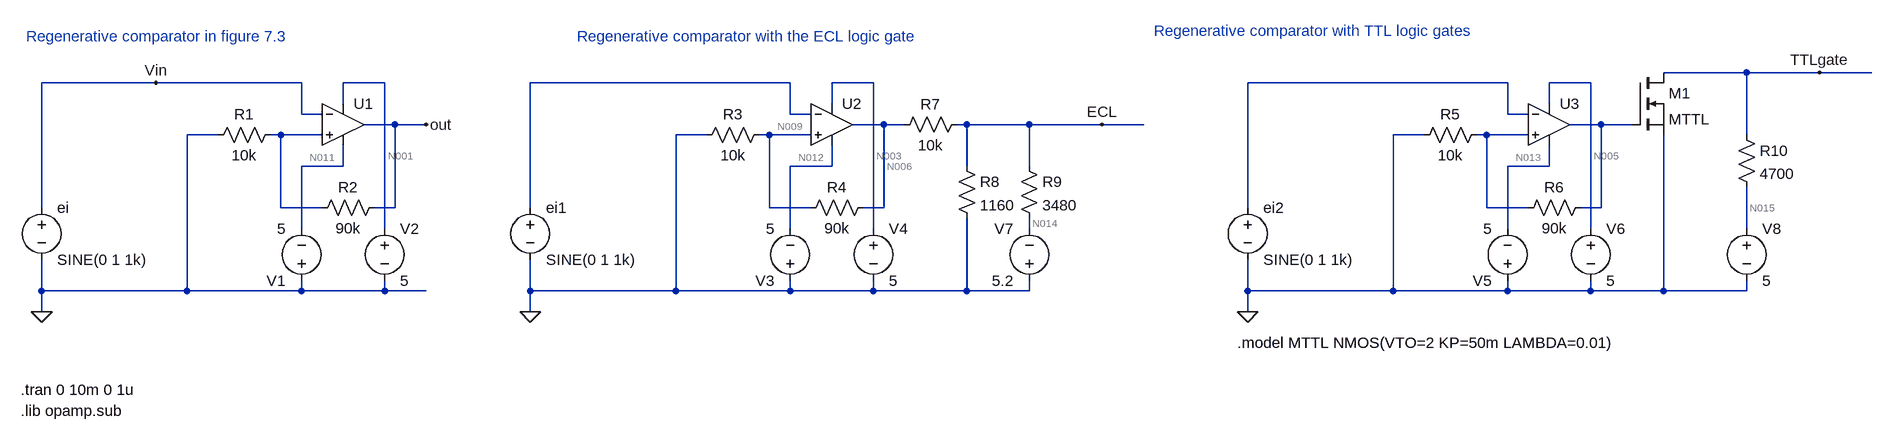
[diagram p0: schematic hw4.asc]
hw4.asc, the LTspice schematic file:
Version 4.1
SHEET 1 2436 680
WIRE 2240 64 2112 64
WIRE 2352 64 2240 64
WIRE 2432 64 2352 64
WIRE -208 80 -384 80
WIRE 16 80 -208 80
WIRE 144 80 80 80
WIRE 768 80 368 80
WIRE 896 80 832 80
WIRE 1872 80 1472 80
WIRE 2000 80 1936 80
WIRE 80 112 80 80
WIRE 832 112 832 80
WIRE 1936 112 1936 80
WIRE 16 128 16 80
WIRE 48 128 16 128
WIRE 768 128 768 80
WIRE 800 128 768 128
WIRE 1872 128 1872 80
WIRE 1904 128 1872 128
WIRE 160 144 112 144
WIRE 208 144 160 144
WIRE 912 144 864 144
WIRE 944 144 912 144
WIRE 1040 144 1024 144
WIRE 1136 144 1040 144
WIRE 1248 144 1136 144
WIRE 1312 144 1248 144
WIRE 2016 144 1968 144
WIRE 2064 144 2016 144
WIRE -112 160 -160 160
WIRE -16 160 -32 160
WIRE 48 160 -16 160
WIRE 640 160 592 160
WIRE 736 160 720 160
WIRE 800 160 736 160
WIRE 1744 160 1696 160
WIRE 1840 160 1824 160
WIRE 1904 160 1840 160
WIRE 2240 160 2240 64
WIRE 80 208 80 176
WIRE 80 208 16 208
WIRE 832 208 832 176
WIRE 832 208 768 208
WIRE 1040 208 1040 144
WIRE 1136 208 1136 144
WIRE 1936 208 1936 176
WIRE 1936 208 1872 208
WIRE -384 272 -384 80
WIRE -16 272 -16 160
WIRE 48 272 -16 272
WIRE 160 272 160 144
WIRE 160 272 128 272
WIRE 368 272 368 80
WIRE 736 272 736 160
WIRE 800 272 736 272
WIRE 912 272 912 144
WIRE 912 272 880 272
WIRE 1472 272 1472 80
WIRE 1840 272 1840 160
WIRE 1904 272 1840 272
WIRE 2016 272 2016 144
WIRE 2016 272 1984 272
WIRE 16 304 16 208
WIRE 144 304 144 80
WIRE 768 304 768 208
WIRE 896 304 896 80
WIRE 1136 304 1136 288
WIRE 1872 304 1872 208
WIRE 2000 304 2000 80
WIRE 2240 304 2240 240
WIRE -384 400 -384 352
WIRE -160 400 -160 160
WIRE -160 400 -384 400
WIRE 16 400 16 384
WIRE 16 400 -160 400
WIRE 144 400 144 384
WIRE 144 400 16 400
WIRE 208 400 144 400
WIRE 368 400 368 352
WIRE 592 400 592 160
WIRE 592 400 368 400
WIRE 768 400 768 384
WIRE 768 400 592 400
WIRE 896 400 896 384
WIRE 896 400 768 400
WIRE 1040 400 1040 288
WIRE 1040 400 896 400
WIRE 1136 400 1136 384
WIRE 1136 400 1040 400
WIRE 1472 400 1472 352
WIRE 1696 400 1696 160
WIRE 1696 400 1472 400
WIRE 1872 400 1872 384
WIRE 1872 400 1696 400
WIRE 2000 400 2000 384
WIRE 2000 400 1872 400
WIRE 2112 400 2112 160
WIRE 2112 400 2000 400
WIRE 2240 400 2240 384
WIRE 2240 400 2112 400
WIRE -384 432 -384 400
WIRE 368 432 368 400
WIRE 1472 432 1472 400
FLAG -384 432 0
FLAG 368 432 0
FLAG 1472 432 0
FLAG 208 144 out
FLAG 1248 144 ECL
FLAG 2352 64 TTLgate
FLAG -208 80 Vin
SYMBOL voltage -384 256 R0
WINDOW 123 0 0 Left 0
WINDOW 39 0 0 Left 0
SYMATTR InstName ei
SYMATTR Value SINE(0 1 1k)
SYMBOL res -16 144 R90
WINDOW 0 0 56 VBottom 2
WINDOW 3 32 56 VTop 2
SYMATTR InstName R1
SYMATTR Value 10k
SYMBOL res 144 256 R90
WINDOW 0 0 56 VBottom 2
WINDOW 3 32 56 VTop 2
SYMATTR InstName R2
SYMATTR Value 90k
SYMBOL voltage 16 400 R180
WINDOW 123 0 0 Left 0
WINDOW 39 0 0 Left 0
SYMATTR InstName V1
SYMATTR Value 5
SYMBOL voltage 144 288 R0
WINDOW 123 0 0 Left 0
WINDOW 39 0 0 Left 0
SYMATTR InstName V2
SYMATTR Value 5
SYMBOL OpAmps\\UniversalOpAmp2 80 144 R0
SYMATTR InstName U1
SYMBOL voltage 368 256 R0
WINDOW 123 0 0 Left 0
WINDOW 39 0 0 Left 0
SYMATTR InstName ei1
SYMATTR Value SINE(0 1 1k)
SYMBOL res 736 144 R90
WINDOW 0 0 56 VBottom 2
WINDOW 3 32 56 VTop 2
SYMATTR InstName R3
SYMATTR Value 10k
SYMBOL res 896 256 R90
WINDOW 0 0 56 VBottom 2
WINDOW 3 32 56 VTop 2
SYMATTR InstName R4
SYMATTR Value 90k
SYMBOL voltage 768 400 R180
WINDOW 123 0 0 Left 0
WINDOW 39 0 0 Left 0
SYMATTR InstName V3
SYMATTR Value 5
SYMBOL voltage 896 288 R0
WINDOW 123 0 0 Left 0
WINDOW 39 0 0 Left 0
SYMATTR InstName V4
SYMATTR Value 5
SYMBOL OpAmps\\UniversalOpAmp2 832 144 R0
SYMATTR InstName U2
SYMBOL voltage 1472 256 R0
WINDOW 123 0 0 Left 0
WINDOW 39 0 0 Left 0
SYMATTR InstName ei2
SYMATTR Value SINE(0 1 1k)
SYMBOL res 1840 144 R90
WINDOW 0 0 56 VBottom 2
WINDOW 3 32 56 VTop 2
SYMATTR InstName R5
SYMATTR Value 10k
SYMBOL res 2000 256 R90
WINDOW 0 0 56 VBottom 2
WINDOW 3 32 56 VTop 2
SYMATTR InstName R6
SYMATTR Value 90k
SYMBOL voltage 1872 400 R180
WINDOW 123 0 0 Left 0
WINDOW 39 0 0 Left 0
SYMATTR InstName V5
SYMATTR Value 5
SYMBOL voltage 2000 288 R0
WINDOW 123 0 0 Left 0
WINDOW 39 0 0 Left 0
SYMATTR InstName V6
SYMATTR Value 5
SYMBOL OpAmps\\UniversalOpAmp2 1936 144 R0
SYMATTR InstName U3
SYMBOL res 1040 128 R90
WINDOW 0 0 56 VBottom 2
WINDOW 3 32 56 VTop 2
SYMATTR InstName R7
SYMATTR Value 10k
SYMBOL res 1024 192 R0
SYMATTR InstName R8
SYMATTR Value 1160
SYMBOL res 1120 192 R0
SYMATTR InstName R9
SYMATTR Value 3480
SYMBOL voltage 1136 400 R180
WINDOW 0 24 96 Left 2
WINDOW 3 24 16 Left 2
WINDOW 123 0 0 Left 0
WINDOW 39 0 0 Left 0
SYMATTR InstName V7
SYMATTR Value 5.2
SYMBOL nmos 2064 64 R0
SYMATTR InstName M1
SYMATTR Value MTTL
SYMBOL voltage 2240 288 R0
WINDOW 123 0 0 Left 0
WINDOW 39 0 0 Left 0
SYMATTR InstName V8
SYMATTR Value 5
SYMBOL res 2224 144 R0
SYMATTR InstName R10
SYMATTR Value 4700
TEXT -416 552 Left 2 !.tran 0 10m 0 1u
TEXT -416 584 Left 2 !.lib opamp.sub
TEXT -408 8 Left 2 ;Regenerative comparator in figure 7.3
TEXT 440 8 Left 2 ;Regenerative comparator with the ECL logic gate
TEXT 1328 0 Left 2 ;Regenerative comparator with TTL logic gates
TEXT 1456 480 Left 2 !.model MTTL NMOS(VTO=2 KP=50m LAMBDA=0.01)

The netlist it stands for:
* hw4.asc
V§ei Vin 0 SINE(0 1 1k)
R1 N008 0 10k
R2 out N008 90k
V1 0 N011 5
V2 N001 0 5
X§U1 N008 Vin N001 N011 out level2 Avol=1Meg GBW=10Meg Slew=10Meg Ilimit=25m Rail=0 Vos=0 En=0 Enk=0 In=0 Ink=0 Rin=500Meg  ; pins In+ In- V+ V- OUT
V§ei1 N002 0 SINE(0 1 1k)
R3 N009 0 10k
R4 N006 N009 90k
V3 0 N012 5
V4 N003 0 5
X§U2 N009 N002 N003 N012 N006 level2 Avol=1Meg GBW=10Meg Slew=10Meg Ilimit=25m Rail=0 Vos=0 En=0 Enk=0 In=0 Ink=0 Rin=500Meg  ; pins In+ In- V+ V- OUT
V§ei2 N004 0 SINE(0 1 1k)
R5 N010 0 10k
R6 N007 N010 90k
V5 0 N013 5
V6 N005 0 5
X§U3 N010 N004 N005 N013 N007 level2 Avol=1Meg GBW=10Meg Slew=10Meg Ilimit=25m Rail=0 Vos=0 En=0 Enk=0 In=0 Ink=0 Rin=500Meg  ; pins In+ In- V+ V- OUT
R7 ECL N006 10k
R8 ECL 0 1160
R9 ECL N014 3480
V7 0 N014 5.2
M1 TTLgate N007 0 0 MTTL
V8 N015 0 5
R10 TTLgate N015 4700
.model NMOS NMOS
.model PMOS PMOS
.lib standard.mos
.tran 0 10m 0 1u
.lib opamp.sub
* Regenerative comparator in figure 7.3
* Regenerative comparator with the ECL logic gate
* Regenerative comparator with TTL logic gates
.model MTTL NMOS(VTO=2 KP=50m LAMBDA=0.01)
.lib UniversalOpAmp2.lib
.backanno
.end

* Results of the author's LTspice run, read from the files saved beside the schematic
* Operating Point, zero values left out:
*   V(ecl) = -1.596 V
*   V(n001) = 5 V
*   V(n003) = 5 V
*   V(n005) = 5 V
*   V(n006) = -4.996 V
*   V(n009) = -499.6 mV
*   V(n011) = -5 V
*   V(n012) = -5 V
*   V(n013) = -5 V
*   V(n014) = -5.2 V
*   V(n015) = 5 V
*   V(ttlgate) = 5 V
*   I(R10) = -10.01 pA
*   I(R3) = -49.96 µA
*   I(R4) = -49.96 µA
*   I(R7) = 340 µA
*   I(R8) = -1.376 mA
*   I(R9) = 1.036 mA
*   I(V1) = -500 µA
*   I(V2) = -500 µA
*   I(V3) = -391 µA
*   I(V4) = -1.158 µA
*   I(V5) = -500 µA
*   I(V6) = -500 µA
*   I(V7) = -1.036 mA
*   I(V8) = -10.01 pA
*   Ib(M1) = -5.01 pA
*   Id(M1) = 10.01 pA
*   Is(M1) = -5 pA
*   Ix(u1:3) = 500 µA
*   Ix(u1:4) = -500 µA
*   Ix(u2:1) = -999.2 pA
*   Ix(u2:3) = 1.158 µA
*   Ix(u2:4) = -391 µA
*   Ix(u2:5) = 390 µA
*   Ix(u3:3) = 500 µA
*   Ix(u3:4) = -500 µA
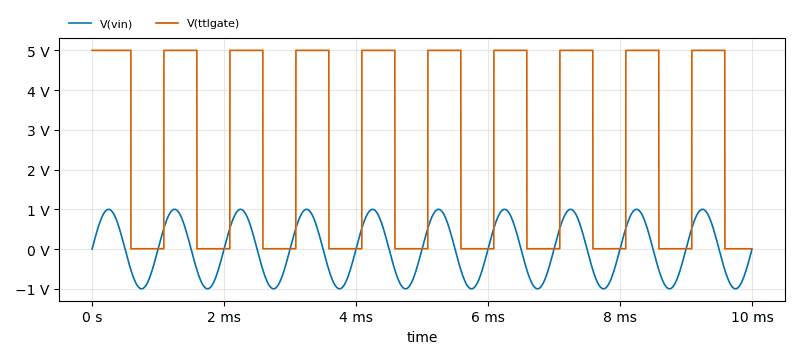
[diagram p1: Transient Analysis of hw4.asc, plotted from the saved traces]
* Transient Analysis, 1 run:
*   V(vin): min -1 V, max 1 V, average 0 V, rms 707.1 mV, last 0 V
*   V(ttlgate): min 7.091 mV, max 5 V, average 2.549 V, rms 3.568 V, last 7.091 mV